# Altium schematic sheet JSP016.SchDoc: ROBOX V2 - General Overview
size A4; DrawnBy: Jan Stappers; DocumentNumber: JSP016; Revision: B; SheetNumber: 1; SheetTotal: 6
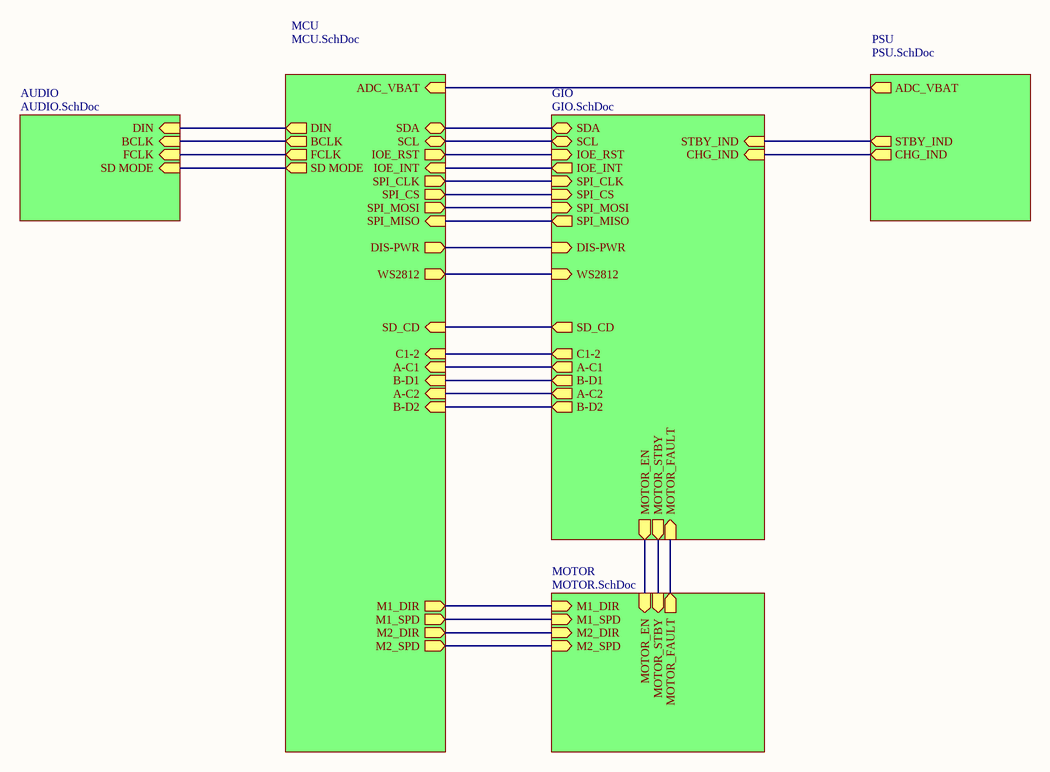
[diagram p0: JSP016.SchDoc]

## Sub-sheets
AUDIO = AUDIO.SchDoc: BCLK (in), SD MODE (in), DIN (in), FCLK (in)
GIO = GIO.SchDoc: SD_CD (out), SPI_CLK (in), SCL (bidir), SPI_CS (in), STBY_IND (in), WS2812 (in), SDA (bidir), SPI_MOSI (in), SPI_MISO (out), IOE_RST (in), A-C1 (out), B-D1 (out), C1-2 (out), MOTOR_EN (out), DIS-PWR (in), MOTOR_STBY (out), CHG_IND (in), A-C2 (out), B-D2 (out), IOE_INT (out), MOTOR_FAULT (in)
MCU = MCU.SchDoc: FCLK (out), SD_CD (in), SPI_CLK (out), SDA (bidir), WS2812 (out), SPI_MISO (in), SPI_MOSI (out), SD MODE (out), SCL (bidir), DIN (out), DIS-PWR (out), BCLK (out), M1_DIR (out), M2_DIR (out), M2_SPD (out), M1_SPD (out), SPI_CS (out), IOE_RST (out), A-C1 (in), B-D1 (in), C1-2 (in), A-C2 (in), B-D2 (in), IOE_INT (in), ADC_VBAT (in)
MOTOR = MOTOR.SchDoc: M2_SPD (in), M2_DIR (in), M1_SPD (in), M1_DIR (in), MOTOR_STBY (in), MOTOR_EN (in), MOTOR_FAULT (out)
PSU = PSU.SchDoc: CHG_IND (out), STBY_IND (out), ADC_VBAT (out)

## Nets
(unnamed): sheet MCU/FCLK, sheet AUDIO/FCLK
(unnamed): sheet MCU/SD_CD, sheet GIO/SD_CD
(unnamed): sheet MCU/SPI_CLK, sheet GIO/SPI_CLK
(unnamed): sheet MCU/SDA, sheet GIO/SDA
(unnamed): sheet MCU/WS2812, sheet GIO/WS2812
(unnamed): sheet MCU/SPI_MISO, sheet GIO/SPI_MISO
(unnamed): sheet MCU/SPI_MOSI, sheet GIO/SPI_MOSI
(unnamed): sheet MCU/SD MODE, sheet AUDIO/SD MODE
(unnamed): sheet MCU/SCL, sheet GIO/SCL
(unnamed): sheet MCU/DIN, sheet AUDIO/DIN
(unnamed): sheet MCU/DIS-PWR, sheet GIO/DIS-PWR
(unnamed): sheet MCU/BCLK, sheet AUDIO/BCLK
(unnamed): sheet MCU/M1_DIR, sheet MOTOR/M1_DIR
(unnamed): sheet MCU/M2_DIR, sheet MOTOR/M2_DIR
(unnamed): sheet MCU/M2_SPD, sheet MOTOR/M2_SPD
(unnamed): sheet MCU/M1_SPD, sheet MOTOR/M1_SPD
(unnamed): sheet MCU/SPI_CS, sheet GIO/SPI_CS
(unnamed): sheet MCU/IOE_RST, sheet GIO/IOE_RST
(unnamed): sheet MCU/A-C1, sheet GIO/A-C1
(unnamed): sheet MCU/B-D1, sheet GIO/B-D1
(unnamed): sheet MCU/C1-2, sheet GIO/C1-2
(unnamed): sheet MCU/A-C2, sheet GIO/A-C2
(unnamed): sheet MCU/B-D2, sheet GIO/B-D2
(unnamed): sheet MCU/IOE_INT, sheet GIO/IOE_INT
(unnamed): sheet MCU/ADC_VBAT, sheet PSU/ADC_VBAT
(unnamed): sheet PSU/CHG_IND, sheet GIO/CHG_IND
(unnamed): sheet PSU/STBY_IND, sheet GIO/STBY_IND
(unnamed): sheet MOTOR/MOTOR_STBY, sheet GIO/MOTOR_STBY
(unnamed): sheet MOTOR/MOTOR_EN, sheet GIO/MOTOR_EN
(unnamed): sheet MOTOR/MOTOR_FAULT, sheet GIO/MOTOR_FAULT

## Notes on the sheet
- Title
- Size:
- Date:
- A4
- Number:
- Time:
- Revision:
- Sheet
- of
- File: